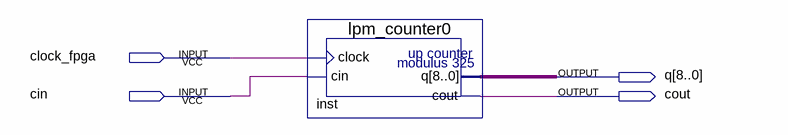
[diagram p0: schematic sheet]
// Quartus schematic contador_divfreq.bdf as structural Verilog: 1 symbols, 4 pins
module contador_divfreq (
  input  clock_fpga,
  input  cin,
  output [8:0] q,
  output cout
);

  lpm_counter0 inst (.clock(clock_fpga), .cin(cin), .cout(cout), .q(q));
endmodule
